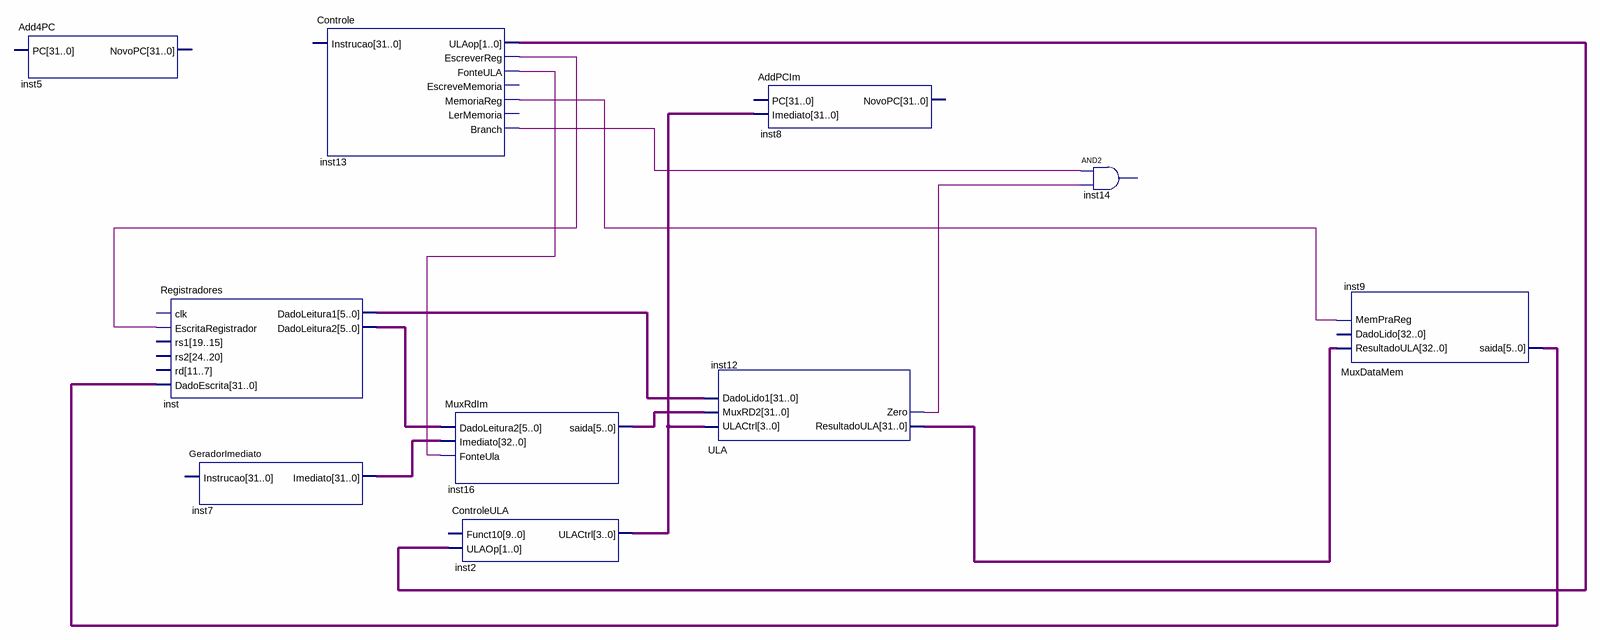
[diagram p0: schematic sheet]
// Quartus schematic Quadro.bdf as structural Verilog: 10 symbols, 0 pins
module Quadro (
);

  wire inst12_zero, inst13_branch, inst13_escreverreg, inst13_fonteula, inst13_memoriareg;
  wire [1:0] inst13_ulaop;
  wire [5:0] inst_dadoleitura2;
  wire [31:0] inst2_ulactrl, inst9_saida, inst16_saida, inst_dadoleitura1;
  wire [32:0] inst7_imediato, inst12_resultadoula;

  Add4PC inst5 ();  // open: PC, NovoPC
  Registradores inst (
    .EscritaRegistrador(inst13_escreverreg), .DadoEscrita(inst9_saida), .DadoLeitura1(inst_dadoleitura1),
    .DadoLeitura2(inst_dadoleitura2));  // open: clk, rs1, rs2, rd
  GeradorImediato inst7 (.Imediato(inst7_imediato));  // open: Instrucao
  Controle inst13 (
    .ULAop(inst13_ulaop), .EscreverReg(inst13_escreverreg), .FonteULA(inst13_fonteula),
    .MemoriaReg(inst13_memoriareg), .Branch(inst13_branch));  // open: Instrucao, EscreveMemoria, LerMemoria
  MuxRdIm inst16 (
    .DadoLeitura2(inst_dadoleitura2), .Imediato(inst7_imediato), .FonteUla(inst13_fonteula),
    .saida(inst16_saida));
  ControleULA inst2 (.ULAOp(inst13_ulaop), .ULACtrl(inst2_ulactrl));  // open: Funct10
  ULA inst12 (
    .ULACtrl(inst2_ulactrl), .MuxRD2(inst16_saida), .DadoLido1(inst_dadoleitura1),
    .ResultadoULA(inst12_resultadoula), .Zero(inst12_zero));
  AddPCIm inst8 (.Imediato(inst2_ulactrl));  // open: PC, NovoPC
  // AND2 inst14 has open pins: IN1=inst13_branch, IN2=inst12_zero, OUT=open
  MuxDataMem inst9 (
    .ResultadoULA(inst12_resultadoula), .MemPraReg(inst13_memoriareg), .saida(inst9_saida));  // open: DadoLido
endmodule
